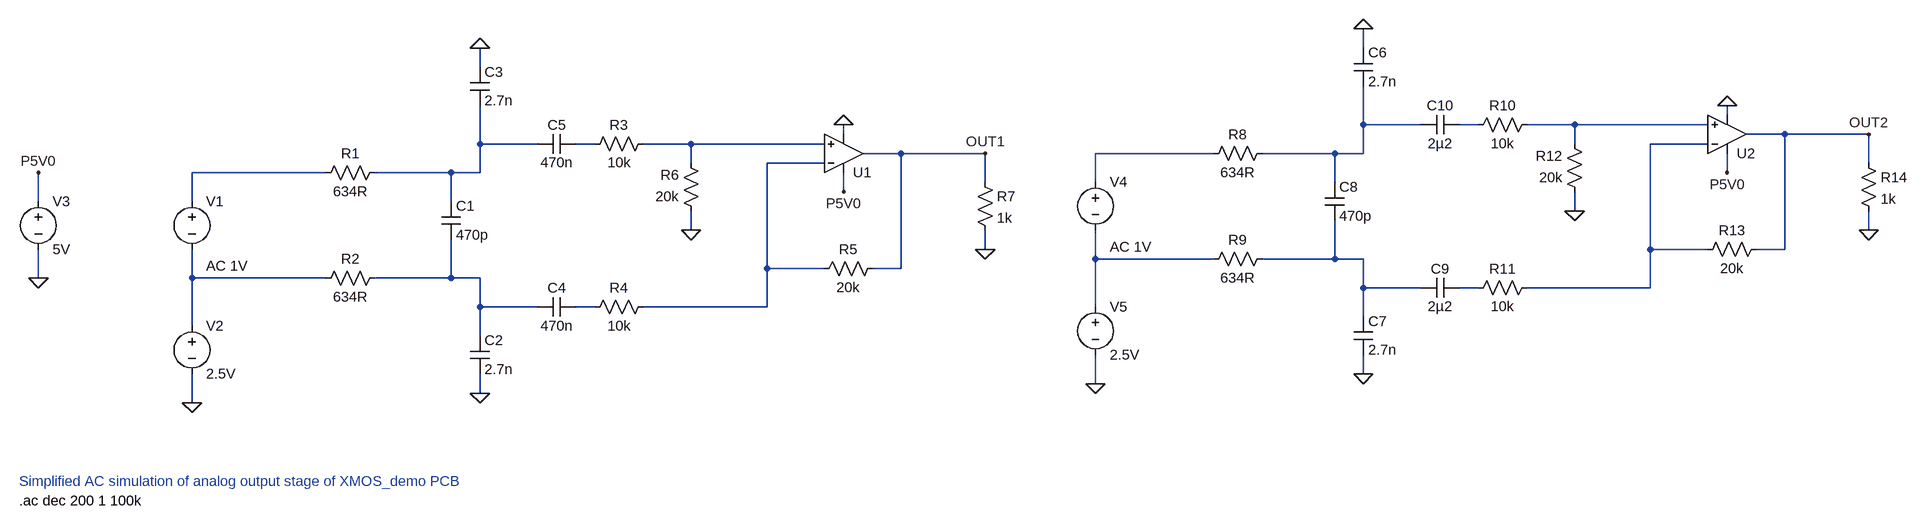
[diagram p0: schematic audio_out.asc]
audio_out.asc, the LTspice schematic file:
Version 4.1
SHEET 1 3316 680
WIRE 2384 -128 2384 -160
WIRE 496 -96 496 -128
WIRE 2992 -16 2992 -32
WIRE 2384 0 2384 -64
WIRE 2480 0 2384 0
WIRE 2576 0 2544 0
WIRE 2736 0 2656 0
WIRE 2960 0 2736 0
WIRE 1104 16 1104 0
WIRE 3088 16 3024 16
WIRE 3248 16 3088 16
WIRE 496 32 496 -32
WIRE 592 32 496 32
WIRE 688 32 656 32
WIRE 848 32 768 32
WIRE 1072 32 848 32
WIRE 2736 32 2736 0
WIRE 2960 32 2864 32
WIRE 1200 48 1136 48
WIRE 1360 48 1200 48
WIRE 2128 48 1904 48
WIRE 2336 48 2208 48
WIRE 2384 48 2384 0
WIRE 2384 48 2336 48
WIRE 848 64 848 32
WIRE 1072 64 976 64
WIRE 3248 64 3248 16
WIRE 240 80 16 80
WIRE 448 80 320 80
WIRE 496 80 496 32
WIRE 496 80 448 80
WIRE 2992 80 2992 48
WIRE 1360 96 1360 48
WIRE 1904 96 1904 48
WIRE 2336 96 2336 48
WIRE 1104 112 1104 80
WIRE -240 128 -240 80
WIRE 16 128 16 80
WIRE 448 128 448 80
WIRE 2736 144 2736 112
WIRE 848 176 848 144
WIRE 3248 176 3248 144
WIRE 1360 208 1360 176
WIRE 2864 208 2864 32
WIRE 2960 208 2864 208
WIRE 3088 208 3088 16
WIRE 3088 208 3040 208
WIRE 1904 224 1904 176
WIRE 2128 224 1904 224
WIRE 2336 224 2336 160
WIRE 2336 224 2208 224
WIRE 2384 224 2336 224
WIRE 976 240 976 64
WIRE 1072 240 976 240
WIRE 1200 240 1200 48
WIRE 1200 240 1152 240
WIRE -240 256 -240 208
WIRE 16 256 16 208
WIRE 240 256 16 256
WIRE 448 256 448 192
WIRE 448 256 320 256
WIRE 496 256 448 256
WIRE 2384 272 2384 224
WIRE 2480 272 2384 272
WIRE 2576 272 2544 272
WIRE 2864 272 2864 208
WIRE 2864 272 2656 272
WIRE 496 304 496 256
WIRE 592 304 496 304
WIRE 688 304 656 304
WIRE 976 304 976 240
WIRE 976 304 768 304
WIRE 1904 304 1904 224
WIRE 2384 320 2384 272
WIRE 16 336 16 256
WIRE 496 352 496 304
WIRE 2384 416 2384 384
WIRE 1904 432 1904 384
WIRE 496 448 496 416
WIRE 16 464 16 416
FLAG 16 464 0
FLAG 496 448 0
FLAG 496 -128 0
FLAG -240 256 0
FLAG -240 80 P5V0
FLAG 1104 112 P5V0
FLAG 848 176 0
FLAG 1104 0 0
FLAG 1360 208 0
FLAG 1904 432 0
FLAG 2384 416 0
FLAG 2384 -160 0
FLAG 2992 80 P5V0
FLAG 2736 144 0
FLAG 2992 -32 0
FLAG 3248 176 0
FLAG 1360 48 OUT1
FLAG 3248 16 OUT2
SYMBOL voltage 16 112 R0
WINDOW 123 24 124 Left 2
WINDOW 39 0 0 Left 0
SYMATTR Value2 AC 1V
SYMATTR InstName V1
SYMATTR Value ""
SYMBOL res 336 64 R90
WINDOW 0 0 56 VBottom 2
WINDOW 3 32 56 VTop 2
SYMATTR InstName R1
SYMATTR Value 634R
SYMBOL res 336 240 R90
WINDOW 0 0 56 VBottom 2
WINDOW 3 32 56 VTop 2
SYMATTR InstName R2
SYMATTR Value 634R
SYMBOL voltage 16 320 R0
WINDOW 123 0 0 Left 0
WINDOW 39 0 0 Left 0
SYMATTR InstName V2
SYMATTR Value 2.5V
SYMBOL cap 432 128 R0
SYMATTR InstName C1
SYMATTR Value 470p
SYMBOL cap 480 352 R0
SYMATTR InstName C2
SYMATTR Value 2.7n
SYMBOL cap 480 -96 R0
SYMATTR InstName C3
SYMATTR Value 2.7n
SYMBOL cap 656 288 R90
WINDOW 0 0 32 VBottom 2
WINDOW 3 32 32 VTop 2
SYMATTR InstName C4
SYMATTR Value 470n
SYMBOL cap 656 16 R90
WINDOW 0 0 32 VBottom 2
WINDOW 3 32 32 VTop 2
SYMATTR InstName C5
SYMATTR Value 470n
SYMBOL OpAmps\\UniversalOpAmp 1104 48 M180
SYMATTR InstName U1
SYMBOL voltage -240 112 R0
WINDOW 123 0 0 Left 0
WINDOW 39 0 0 Left 0
SYMATTR InstName V3
SYMATTR Value 5V
SYMBOL res 784 16 R90
WINDOW 0 0 56 VBottom 2
WINDOW 3 32 56 VTop 2
SYMATTR InstName R3
SYMATTR Value 10k
SYMBOL res 784 288 R90
WINDOW 0 0 56 VBottom 2
WINDOW 3 32 56 VTop 2
SYMATTR InstName R4
SYMATTR Value 10k
SYMBOL res 864 160 R180
WINDOW 0 36 76 Left 2
WINDOW 3 36 40 Left 2
SYMATTR InstName R6
SYMATTR Value 20k
SYMBOL res 1168 224 R90
WINDOW 0 0 56 VBottom 2
WINDOW 3 32 56 VTop 2
SYMATTR InstName R5
SYMATTR Value 20k
SYMBOL res 1344 80 R0
SYMATTR InstName R7
SYMATTR Value 1k
SYMBOL voltage 1904 80 R0
WINDOW 123 24 124 Left 2
WINDOW 39 0 0 Left 0
SYMATTR Value2 AC 1V
SYMATTR InstName V4
SYMATTR Value ""
SYMBOL res 2224 32 R90
WINDOW 0 0 56 VBottom 2
WINDOW 3 32 56 VTop 2
SYMATTR InstName R8
SYMATTR Value 634R
SYMBOL res 2224 208 R90
WINDOW 0 0 56 VBottom 2
WINDOW 3 32 56 VTop 2
SYMATTR InstName R9
SYMATTR Value 634R
SYMBOL voltage 1904 288 R0
WINDOW 123 0 0 Left 0
WINDOW 39 0 0 Left 0
SYMATTR InstName V5
SYMATTR Value 2.5V
SYMBOL cap 2368 -128 R0
SYMATTR InstName C6
SYMATTR Value 2.7n
SYMBOL cap 2544 256 R90
WINDOW 0 0 32 VBottom 2
WINDOW 3 32 32 VTop 2
SYMATTR InstName C9
SYMATTR Value 2µ2
SYMBOL cap 2544 -16 R90
WINDOW 0 0 32 VBottom 2
WINDOW 3 32 32 VTop 2
SYMATTR InstName C10
SYMATTR Value 2µ2
SYMBOL OpAmps\\UniversalOpAmp 2992 16 M180
SYMATTR InstName U2
SYMBOL res 2672 -16 R90
WINDOW 0 0 56 VBottom 2
WINDOW 3 32 56 VTop 2
SYMATTR InstName R10
SYMATTR Value 10k
SYMBOL res 2672 256 R90
WINDOW 0 0 56 VBottom 2
WINDOW 3 32 56 VTop 2
SYMATTR InstName R11
SYMATTR Value 10k
SYMBOL res 2752 128 R180
WINDOW 0 36 76 Left 2
WINDOW 3 36 40 Left 2
SYMATTR InstName R12
SYMATTR Value 20k
SYMBOL res 3056 192 R90
WINDOW 0 0 56 VBottom 2
WINDOW 3 32 56 VTop 2
SYMATTR InstName R13
SYMATTR Value 20k
SYMBOL res 3232 48 R0
SYMATTR InstName R14
SYMATTR Value 1k
SYMBOL cap 2320 96 R0
SYMATTR InstName C8
SYMATTR Value 470p
SYMBOL cap 2368 320 R0
SYMATTR InstName C7
SYMATTR Value 2.7n
TEXT -272 632 Left 2 !.ac dec 200 1 100k
TEXT -272 600 Left 2 ;Simplified AC simulation of analog output stage of XMOS_demo PCB

The netlist it stands for:
* audio_out.asc
V1 N010 N013 AC 1V
R1 N004 N010 634R
R2 N014 N013 634R
V2 N013 0 2.5V
C1 N004 N014 470p
C2 N014 0 2.7n
C3 0 N004 2.7n
C4 N016 N014 470n
C5 N005 N004 470n
X§U1 N006 N009 P5V0 0 OUT1 level1 Avol=1Meg GBW=10Meg Vos=0 En=0 Enk=0 In=0 Ink=0 Rin=500Meg  ; pins In+ In- V+ V- OUT
V3 P5V0 0 5V
R3 N006 N005 10k
R4 N009 N016 10k
R6 0 N006 20k
R5 OUT1 N009 20k
R7 OUT1 0 1k
V4 N008 N011 AC 1V
R8 N001 N008 634R
R9 N012 N011 634R
V5 N011 0 2.5V
C6 0 N001 2.7n
C9 N015 N012 2µ2
C10 N002 N001 2µ2
X§U2 N003 N007 P5V0 0 OUT2 level1 Avol=1Meg GBW=10Meg Vos=0 En=0 Enk=0 In=0 Ink=0 Rin=500Meg  ; pins In+ In- V+ V- OUT
R10 N003 N002 10k
R11 N007 N015 10k
R12 0 N003 20k
R13 OUT2 N007 20k
R14 OUT2 0 1k
C8 N001 N012 470p
C7 N012 0 2.7n
.ac dec 200 1 100k
* Simplified AC simulation of analog output stage of XMOS_demo PCB
.lib UniversalOpAmp1.lib
.backanno
.end